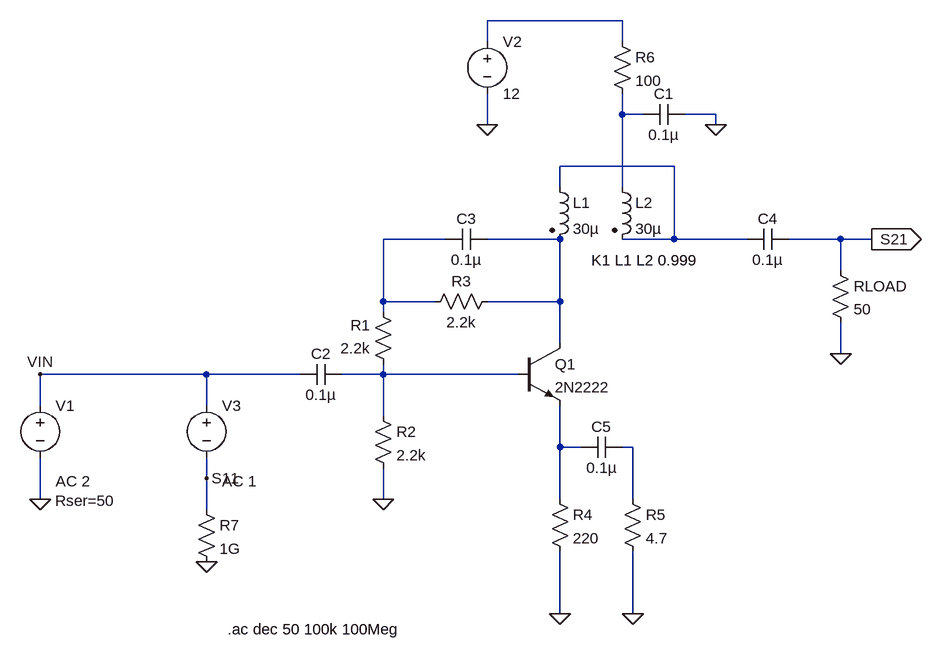
[diagram p0: schematic Broadband RF Amp.asc]
Broadband RF Amp.asc, the LTspice schematic file:
Version 4
SHEET 1 880 708
WIRE 272 -304 64 -304
WIRE 64 -272 64 -304
WIRE 272 -272 272 -304
WIRE 272 -160 272 -192
WIRE 304 -160 272 -160
WIRE 416 -160 368 -160
WIRE 64 -144 64 -192
WIRE 416 -144 416 -160
WIRE 352 -80 176 -80
WIRE 176 -48 176 -80
WIRE 272 -48 272 -160
WIRE 0 32 -96 32
WIRE 176 32 64 32
WIRE 352 32 352 -80
WIRE 352 32 272 32
WIRE 464 32 352 32
WIRE 608 32 528 32
WIRE 656 32 608 32
WIRE 608 80 608 32
WIRE -96 128 -96 32
WIRE -16 128 -96 128
WIRE 176 128 176 32
WIRE 176 128 64 128
WIRE -96 144 -96 128
WIRE 176 192 176 128
WIRE 608 208 608 160
WIRE -368 240 -624 240
WIRE -224 240 -368 240
WIRE -96 240 -96 224
WIRE -96 240 -160 240
WIRE 112 240 -96 240
WIRE -624 288 -624 240
WIRE -368 288 -368 240
WIRE -96 304 -96 240
WIRE 176 352 176 288
WIRE 208 352 176 352
WIRE 288 352 272 352
WIRE -368 400 -368 368
WIRE -624 432 -624 368
WIRE -96 432 -96 384
WIRE 176 432 176 352
WIRE 288 432 288 352
WIRE -368 448 -368 400
WIRE 176 608 176 512
WIRE 288 608 288 512
FLAG -96 432 0
FLAG 176 608 0
FLAG 288 608 0
FLAG 416 -144 0
FLAG 64 -144 0
FLAG -624 432 0
FLAG 608 208 0
FLAG 656 32 S21
IOPIN 656 32 Out
FLAG -624 240 VIN
FLAG -368 528 0
FLAG -368 400 S11
SYMBOL npn 112 192 R0
SYMATTR InstName Q1
SYMATTR Value 2N2222
SYMBOL res -80 240 R180
WINDOW 0 36 76 Left 0
WINDOW 3 36 40 Left 0
SYMATTR InstName R1
SYMATTR Value 2.2k
SYMBOL res -112 288 R0
SYMATTR InstName R2
SYMATTR Value 2.2k
SYMBOL res 80 112 R90
WINDOW 0 0 56 VBottom 0
WINDOW 3 32 56 VTop 0
SYMATTR InstName R3
SYMATTR Value 2.2k
SYMBOL res 160 416 R0
SYMATTR InstName R4
SYMATTR Value 220
SYMBOL res 272 416 R0
SYMATTR InstName R5
SYMATTR Value 4.7
SYMBOL res 256 -288 R0
SYMATTR InstName R6
SYMATTR Value 100
SYMBOL ind2 160 -64 R0
SYMATTR InstName L1
SYMATTR Value 30µ
SYMATTR Type ind
SYMBOL ind2 256 -64 R0
SYMATTR InstName L2
SYMATTR Value 30µ
SYMATTR Type ind
SYMBOL cap 368 -176 R90
WINDOW 0 0 32 VBottom 0
WINDOW 3 32 32 VTop 0
SYMATTR InstName C1
SYMATTR Value 0.1µ
SYMBOL cap -160 224 R90
WINDOW 0 0 32 VBottom 0
WINDOW 3 32 32 VTop 0
SYMATTR InstName C2
SYMATTR Value 0.1µ
SYMBOL cap 64 16 R90
WINDOW 0 0 32 VBottom 0
WINDOW 3 32 32 VTop 0
SYMATTR InstName C3
SYMATTR Value 0.1µ
SYMBOL cap 528 16 R90
WINDOW 0 0 32 VBottom 0
WINDOW 3 32 32 VTop 0
SYMATTR InstName C4
SYMATTR Value 0.1µ
SYMBOL cap 208 368 R270
WINDOW 0 32 32 VTop 0
WINDOW 3 0 32 VBottom 0
SYMATTR InstName C5
SYMATTR Value 0.1µ
SYMBOL voltage -624 272 R0
WINDOW 123 24 132 Left 0
WINDOW 39 23 162 Left 0
SYMATTR Value2 AC 2
SYMATTR SpiceLine Rser=50
SYMATTR InstName V1
SYMATTR Value ""
SYMBOL voltage 64 -288 R0
WINDOW 123 0 0 Left 0
WINDOW 39 0 0 Left 0
SYMATTR InstName V2
SYMATTR Value 12
SYMBOL res 592 64 R0
SYMATTR InstName RLOAD
SYMATTR Value 50
SYMBOL voltage -368 272 R0
WINDOW 123 24 132 Left 0
WINDOW 39 23 162 Left 0
SYMATTR Value2 AC 1
SYMATTR InstName V3
SYMATTR Value ""
SYMBOL res -384 432 R0
SYMATTR InstName R7
SYMATTR Value 1G
TEXT 224 64 Left 0 !K1 L1 L2 0.999
TEXT -336 632 Left 0 !.ac dec 50 100k 100Meg

The netlist it stands for:
* Broadband RF Amp.asc
Q1 N005 N006 N007 0 2N2222
R1 N006 N004 2.2k
R2 N006 0 2.2k
R3 N005 N004 2.2k
R4 N007 0 220
R5 N008 0 4.7
R6 N001 N002 100
L1 N003 N005 30µ
L2 N002 N003 30µ
C1 0 N002 0.1µ
C2 N006 VIN 0.1µ
C3 N005 N004 0.1µ
C4 S21 N003 0.1µ
C5 N007 N008 0.1µ
V1 VIN 0 AC 2 Rser=50
V2 N001 0 12
RLOAD S21 0 50
V3 VIN S11 AC 1
R7 S11 0 1G
.model NPN NPN
.model PNP PNP
.lib standard.bjt
K1 L1 L2 0.999
.ac dec 50 100k 100Meg
.backanno
.end